# EAGLE design squonk (EAGLE 7.5.0)
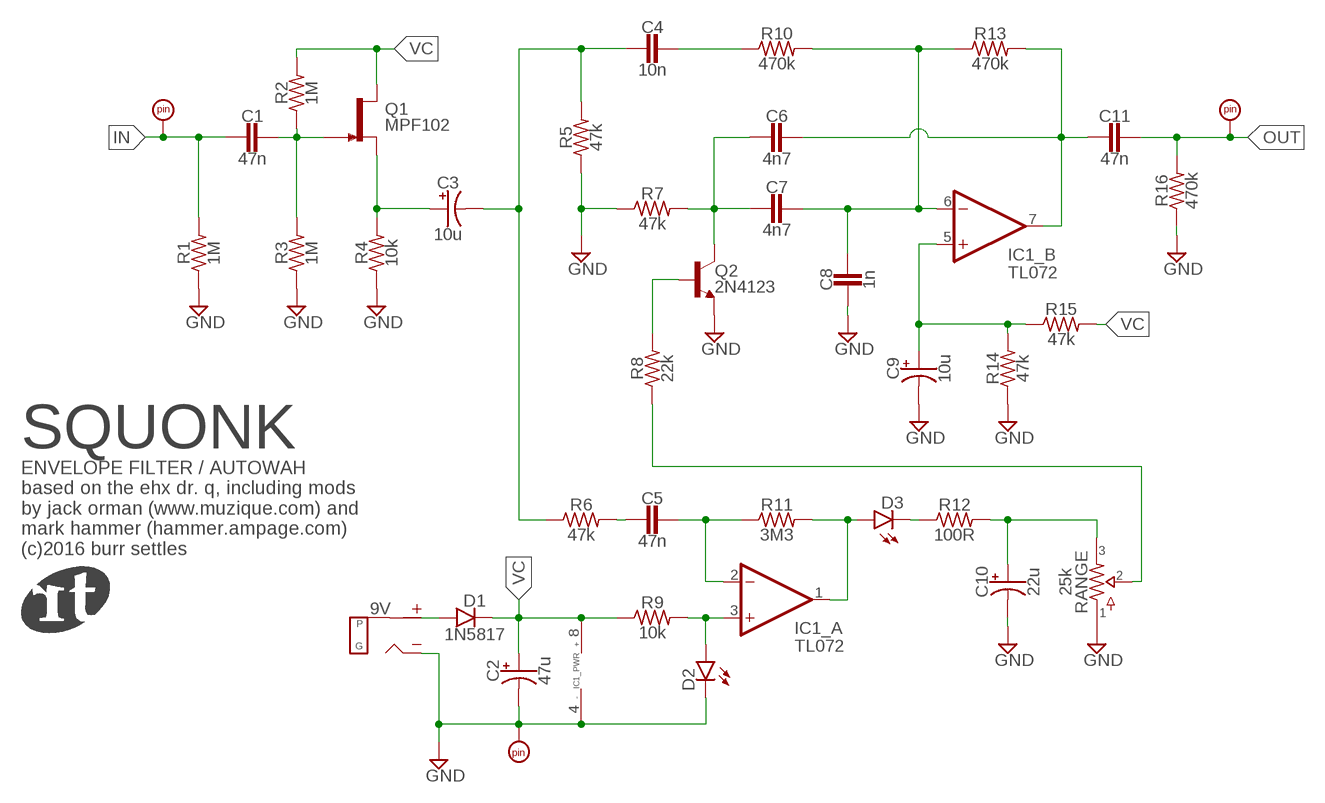
[diagram p0: schematic, sheet 1]

## Parts
9V  DC_MONO  [DC]
C1  47n  CER/FILM2  [050X030_025_2]
C2  47u  0501  [050_020_1]
C3  10u  0501  [050_020_1]
C4  10n  CER/FILM2  [050X030_025_2]
C5  47n  CER/FILM2  [050X030_025_2]
C6  4n7  CER/FILM2  [050X030_025_2]
C7  4n7  CER/FILM2  [050X030_025_2]
C8  1n  CER/FILM2  [050X030_025_2]
C9  10u  0501  [050_020_1]
C10  22u  0501  [050_020_1]
C11  47n  CER/FILM2  [050X030_025_2]
D1  1N5817  DO41.3  [DO41-3]
D2  LEDB  [3MM_B]
D3  LEDB  [3MM_B]
GND  PADRND  [ROUND]
IC1  TL072  DUALTH  [DIL08]
IN  PADSQR  [SQUARE]
OUT  PADSQR  [SQUARE]
Q1  MPF102  2N5457  [TO92-]
Q2  2N4123  2N3904  [TO92-]
R1  1M  R_.3B  [R0207/3]
R2  1M  R_.3B  [R0207/3]
R3  1M  R_.3B  [R0207/3]
R4  10k  R_.3B  [R0207/3]
R5  47k  R_.3B  [R0207/3]
R6  47k  R_.3B  [R0207/3]
R7  47k  R_.3B  [R0207/3]
R8  22k  R_.3B  [R0207/3]
R9  10k  R_.3B  [R0207/3]
R10  470k  R_.3B  [R0207/3]
R11  3M3  R_.3B  [R0207/3]
R12  100R  R_.3B  [R0207/3]
R13  470k  R_.3B  [R0207/3]
R14  47k  R_.3B  [R0207/3]
R15  47k  R_.3B  [R0207/3]
R16  470k  R_.3B  [R0207/3]
RANGE  25k  POTSSMALL_PADS  [PADS_SMALL]

## Nets
GND: 9V.S(SLEEVE) C2.- C8.2 C9.- C10.- D2.K(C) GND.1 IC1.4(_PWR:V-) Q2.3(E) R1.1 R3.1 R4.1 R5.1 R7.1 R14.1 R16.1 RANGE.1
IN: C1.2 IN.1 R1.2
N$1: C1.1 Q1.1(G) R2.1 R3.2
N$2: C3.+ Q1.2(S) R4.2
N$3: C3.- C4.2 R5.2 R6.1
N$6: C5.2 R6.2
N$7: D2.A IC1.3(_A:+IN) R9.2
N$8: C5.1 IC1.2(_A:-IN) R11.1
N$9: D3.A IC1.1(_A:OUT) R11.2
N$10: D3.K(C) R12.1
N$11: C10.+ R12.2 RANGE.3
N$13: 9V.T(TIP) D1.A
N$14: C7.1 C8.1 IC1.6(_B:-IN) R10.2 R13.1
N$16: Q2.2(B) R8.2
N$17: R8.1 RANGE.2
N$19: C6.2 C7.2 Q2.1(C) R7.2
N$20: C6.1 C11.2 IC1.7(_B:OUT) R13.2
N$23: C4.1 R10.1
N$25: C9.+ IC1.5(_B:+IN) R14.2 R15.1
OUT: C11.1 OUT.1 R16.2
VC: C2.+ D1.C IC1.8(_PWR:V+) Q1.3(D) R2.2 R9.1 R15.2

## Notes on the sheet
- SQUONK
- ENVELOPE FILTER / AUTOWAH
  based on the ehx dr. q, including mods
  by jack orman (www.muzique.com) and
  mark hammer (hammer.ampage.com)
  (c)2016 burr settles

## Library data of the parts
9V = jacks:DC_MONO
C1 C4-C8 C11 = capacitors-film:CER/FILM: 47 - 120pF Xicon Ceramic Disc 2.5mm lead spacing
C2 C3 C9 C10 = capacitors-elec:050: 0.22 - 100uF Xicon values at Mouser.com: 10V: 10 - 100uF; 16V: 2.2 - 47uF; 25V: 0.47 - 47uF; 50V: 0.22 - 22uF
D1 = diodes:DO41: DO-41 Package Diodes: 1N4001 - 1N40019 Zener Diodes: 1N4728 - 1N4764
D2 D3 = diodes:LED
GND IN OUT = supply pins:PAD
IC1 = integrated circuits:DUAL: OP AMP
Q1 = transistors:2N5457: N-CHANNEL JFET
Q2 = transistors:2N3904: NPN Transistor
R1-R16 = resistors:R_
RANGE = potentiometers:POTS

## Board
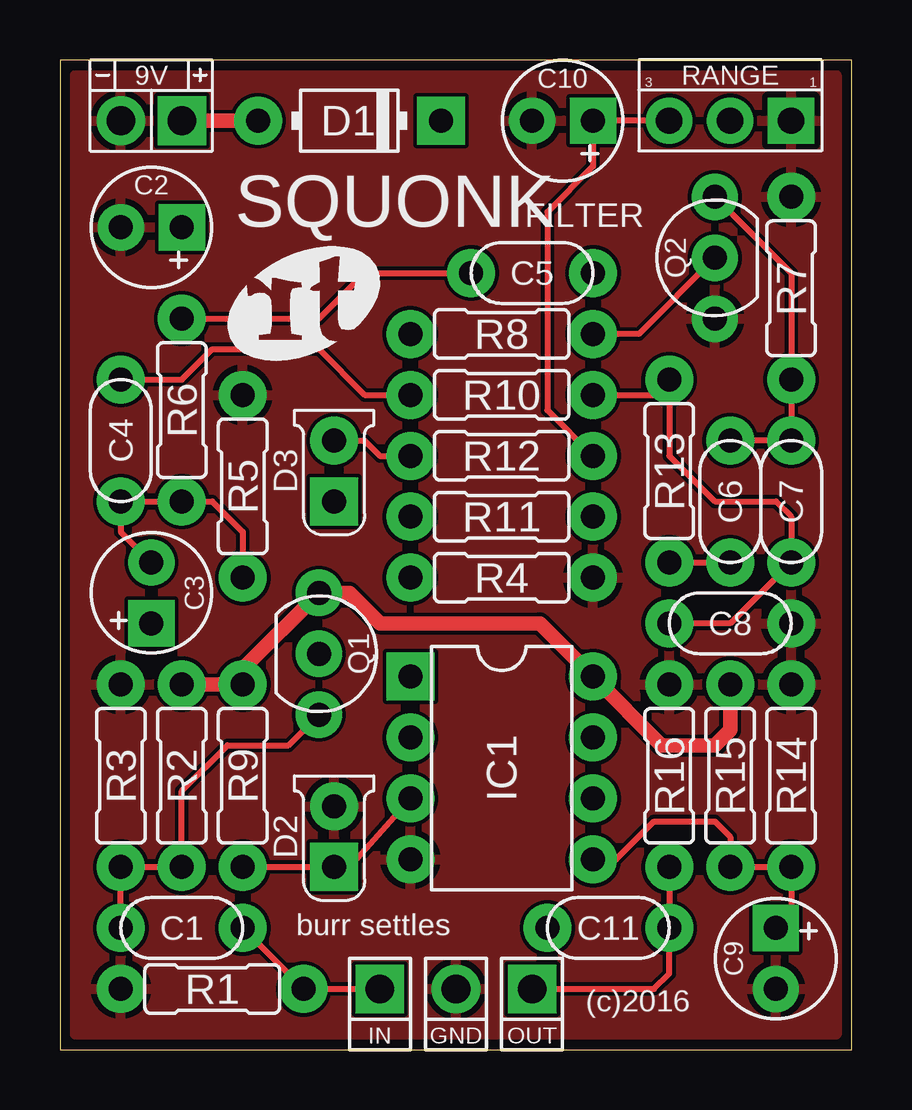
[diagram p1: board, top side]
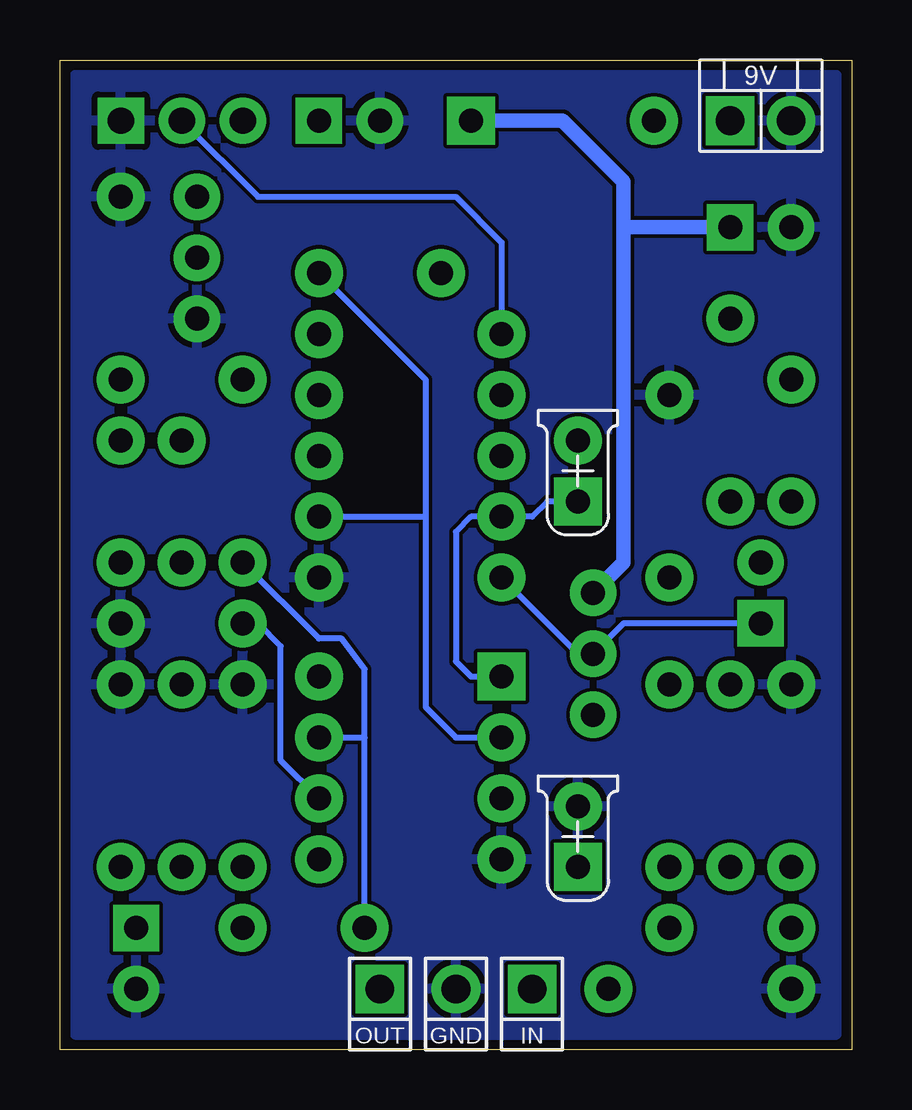
[diagram p2: board, bottom side, seen from below]

Size 33.02 x 41.27 mm. Coordinates in mm from the lower left corner, seen from the top.
Outline: 0,0 33.02,0 33.02,41.27 0,41.27 0,0
Copper layers (1*16): Top 0.0356mm / dielectric 1.5011mm / Bottom 0.0356mm
Design rules "oshpark-2layer": minimum track width 6mil, minimum drill 13mil, track to track 6mil, track to pad 6mil, pad to pad 6mil, via to via 6mil, smd to smd 6mil, copper to edge 15mil, drill to drill 6mil, minimum pad ring 7mil, minimum via ring 7mil, stop-mask expansion 2.5mil, vias tented up to drill 0mil, thermal gap 10mil

### Footprints (pad centres in the part's own frame; a part is rotated, then mirrored left to right if it is on the bottom)
DC = drill 1.2 pad 2.032: S -1.27,0 | drill 1.2 pad 2.032 square: T 1.27,0
050X030_025_2 = drill 1 pad 2: 1 -2.54,0; 2 2.54,0
050_020_1 = drill 1 pad 1.93 square: + -1.27,0 | drill 1 pad 1.93: - 1.27,0
DO41-3 = drill 1 pad 2: A 3.81,0 | drill 1 pad 2 square: C -3.81,0
3MM_B = drill 1 pad 2 square: A -1.27,0 | drill 1 pad 2: K 1.27,0
ROUND = drill 1.2 pad 2.032: 1 0,0
DIL08 = drill 1 pad 2 square: 1 -3.81,-3.81 | drill 1 pad 2: 2 -1.27,-3.81; 3 1.27,-3.81; 4 3.81,-3.81; 5 3.81,3.81; 6 1.27,3.81; 7 -1.27,3.81; 8 -3.81,3.81
SQUARE = drill 1.2 pad 2.032 square: 1 0,0
TO92- = drill 1 pad 1.93: 1 2.54,0; 2 0,0; 3 -2.54,0
R0207/3 = drill 1 pad 2: 1 -3.81,0; 2 3.81,0
PADS_SMALL = drill 1.1 pad 1.93 square: 1 2.54,0 | drill 1.1 pad 1.93: 2 0,0; 3 -2.54,0

### Placement (x,y rotation side)
9V  3.81,38.73 0 top
C1  5.08,5.08 0 top
C2  3.81,34.29 180 top
C3  3.81,19.05 90 top
C4  2.54,25.4 270 top
C5  19.68,32.38 180 top
C6  27.94,22.86 90 top
C7  30.48,22.86 90 top
C8  27.94,17.78 0 top
C9  29.84,3.81 270 top
C10  20.95,38.73 180 top
C11  22.86,5.08 180 top
D1  12.06,38.73 180 top
D2  11.43,8.89 90 top
D3  11.43,24.13 90 top
GND  16.51,2.54 0 top
IC1  18.41,11.75 270 top
IN  13.34,2.54 0 top
OUT  19.68,2.54 0 top
Q1  10.79,16.51 270 top
Q2  27.3,33.02 90 top
R1  6.35,2.54 0 top
R2  5.08,11.43 90 top
R3  2.54,11.43 270 top
R4  18.41,19.68 180 top
R5  7.62,23.5 270 top
R6  5.08,26.67 90 top
R7  30.48,31.75 270 top
R8  18.41,29.84 0 top
R9  7.62,11.43 270 top
R10  18.41,27.3 0 top
R11  18.41,22.23 180 top
R12  18.41,24.77 0 top
R13  25.4,24.13 270 top
R14  30.48,11.43 270 top
R15  27.94,11.43 90 top
R16  25.4,11.43 270 top
RANGE  27.94,38.73 0 top
U$1  [RT0250]  10.16,31.11 0 top

### Tracks (layer width: path | path; a pad name or v marks a point on that pad's centre or on a via)
GND
  pour Bottom: 0.64,40.64 32.38,40.64 32.38,0.64 0.64,0.64
  pour Top: 0.64,40.64 32.38,40.64 32.38,0.64 0.64,0.64
IN
  Top 0.254: C1.2 R1.2 IN.1
N$1
  Top 0.254: C1.1 R3.2 R2.1 5.08,10.79 6.99,12.7 9.53,12.7 Q1.1
N$2
  Bottom 0.254: C3.+ 9.53,17.78 Q1.2 11.43,16.51 R4.2
N$3
  Top 0.254: R5.2 7.62,21.59 6.35,22.86 R6.1 C4.2 2.54,21.59 C3.-
N$6
  Top 0.254: R6.2 10.79,30.48 12.7,32.38 C5.2
N$7
  Top 0.254: R9.2 D2.A 12.06,7.62 IC1.3
N$8
  Bottom 0.254: C5.1 17.78,27.94 17.78,22.23 | 17.78,22.23 17.78,14.29 16.51,13.02 IC1.2 | R11.1 17.78,22.23
N$9
  Bottom 0.254: D3.A 12.7,22.86 13.34,22.23 R11.2 15.88,22.23 16.51,21.59 16.51,16.19 15.88,15.56 IC1.1
N$10
  Top 0.254: D3.K 12.7,25.4 13.34,24.77 R12.1
N$11
  Top 0.254: RANGE.3 C10.+ 22.23,36.83 20.32,34.92 20.32,26.67 R12.2
N$13
  Top 0.61: 9V.T D1.A
N$14
  Top 0.254: R10.2 24.77,27.3 R13.1 25.4,24.77 27.3,22.86 29.84,22.86 30.48,22.23 C7.1 27.94,17.78 C8.1
  Bottom 0.254: IC1.6 23.81,12.06 23.81,16.83 24.77,17.78 C8.1
N$16
  Top 0.254: Q2.2 24.13,29.84 R8.2
N$17
  Bottom 0.254: RANGE.2 24.77,35.56 16.51,35.56 14.61,33.66 R8.1
N$19
  Top 0.254: Q2.1 30.48,32.38 R7.2 C7.2 C6.2
N$20
  Top 0.254: R13.2 C6.1
  Bottom 0.254: C11.2 20.32,13.02 | 20.32,13.02 20.32,15.88 21.27,17.14 22.23,17.14 R13.2 | IC1.7 20.32,13.02
N$23
  Top 0.254: C4.1 5.08,27.94 6.35,29.21 10.79,29.21 12.7,27.3 R10.1
N$25
  Top 0.254: C9.+ 30.48,5.71 R14.2 R15.1 27.94,8.89 27.3,9.53 24.77,9.53 23.18,7.94 IC1.5
OUT
  Top 0.254: OUT.1 24.77,2.54 25.4,3.17 C11.1 R16.2
VC
  Top 0.61: R2.2 R9.1 7.62,15.88 Q1.3 12.06,19.05 13.34,17.78 20,17.78 IC1.8 25.08,12.7 27.3,12.7 27.94,13.34 R15.2
  Bottom 0.61: Q1.3 9.53,20.32 9.53,34.29 | 9.53,34.29 9.53,36.2 12.06,38.73 D1.C | C2.+ 9.53,34.29

### Text on the board
tPlace: SQUONK | FILTER | burr settles | (c)2016